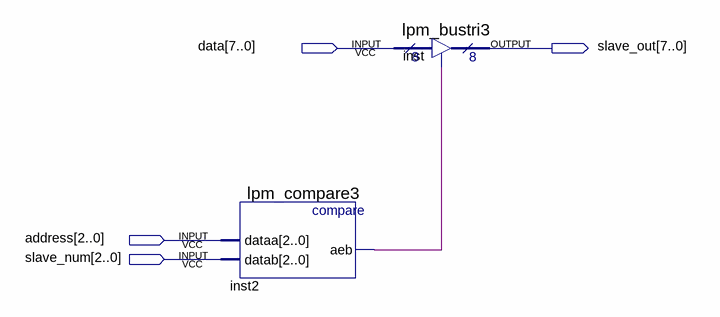
[diagram p0: schematic sheet]
// Quartus schematic slave.bdf as structural Verilog: 2 symbols, 4 pins
module slave (
  input  [7:0] data,
  input  [2:0] address,
  input  [2:0] slave_num,
  output [7:0] slave_out
);

  wire inst2_aeb;

  lpm_compare3 inst2 (.dataa(address), .datab(slave_num), .aeb(inst2_aeb));
  lpm_bustri3 inst (.enabledt(inst2_aeb), .data(data), .tridata(slave_out));
endmodule
